# EAGLE design Linkable_LED_Matrix_Seperate_RES (EAGLE 6.5.0)
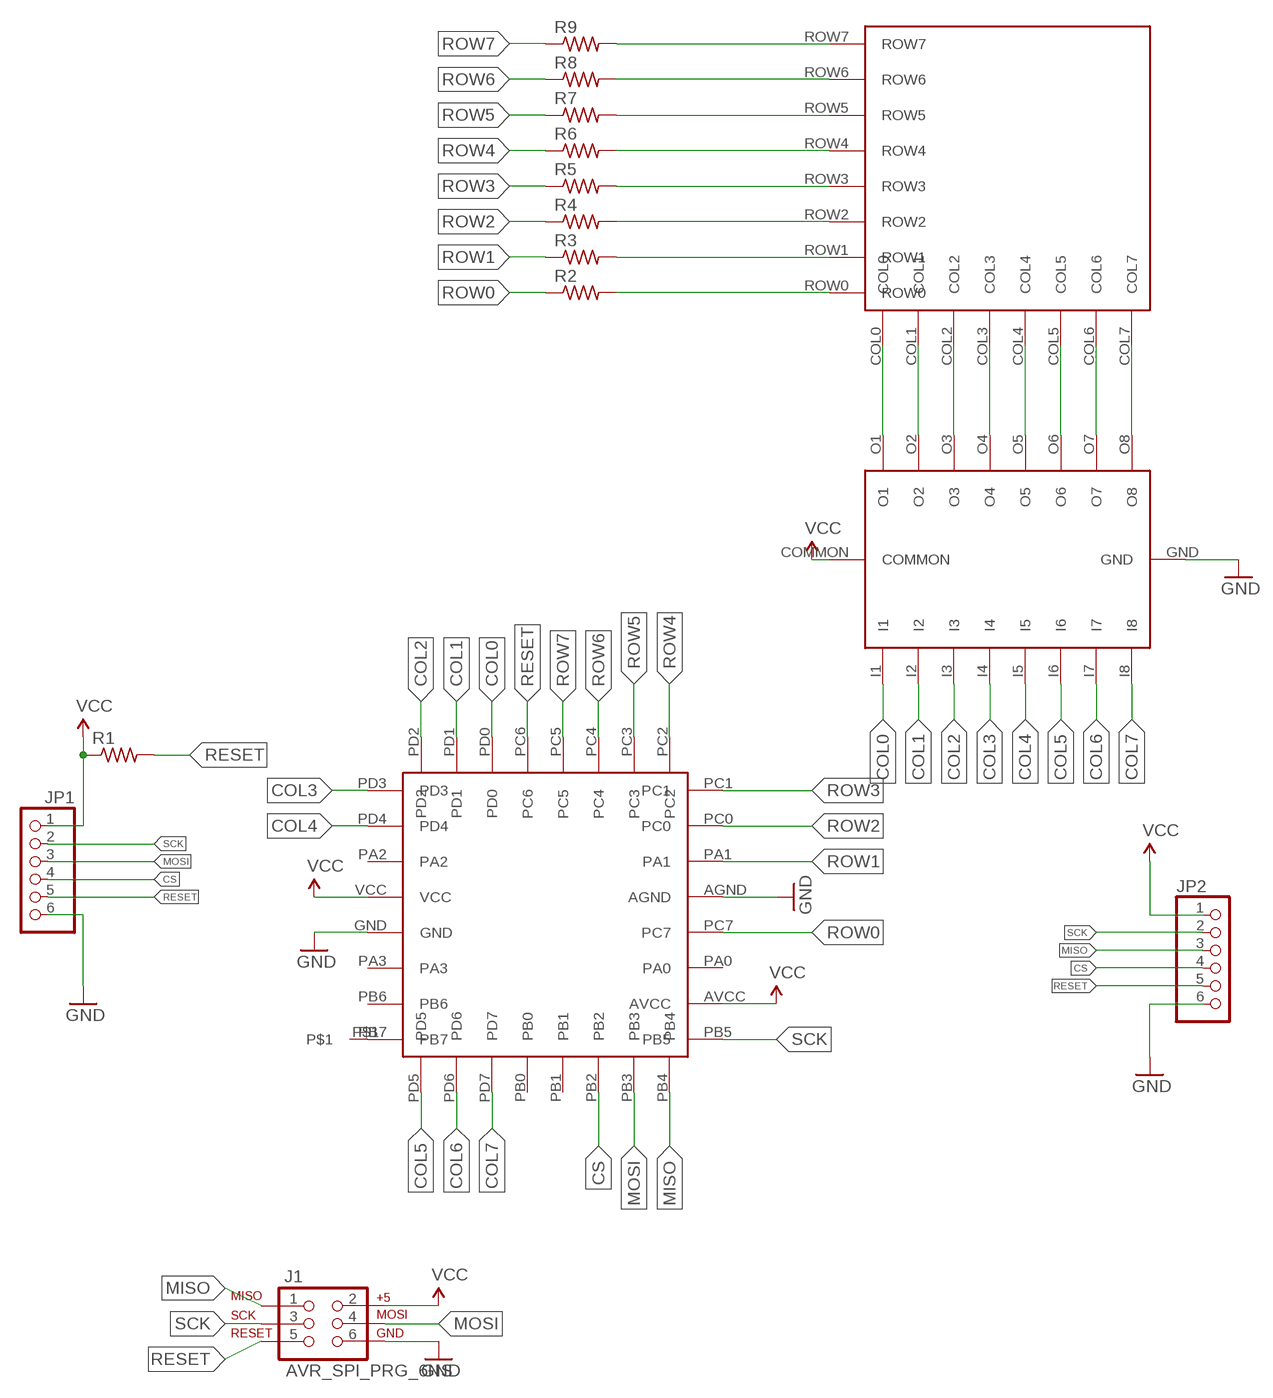
[diagram p0: schematic, sheet 1]

## Parts
J1  AVR_SPI_PRG_6NS  [2X3-NS]
JP1  PINHD-1X6  [1X06]
JP2  PINHD-1X6  [1X06]
R1  R-US_R0603  [R0603]
R2  R-US_R0603  [R0603]
R3  R-US_R0603  [R0603]
R4  R-US_R0603  [R0603]
R5  R-US_R0603  [R0603]
R6  R-US_R0603  [R0603]
R7  R-US_R0603  [R0603]
R8  R-US_R0603  [R0603]
R9  R-US_R0603  [R0603]
U$1  ATTINY48  [ATTINY48]
U$2  ULN2803AFWG  [ULN2803AFWG]
U$3  8X8_LED_MATRIX  [8X8_LED_MATRIX]
U$4  1X1MM_PAD  [1X1MM_PAD]

## Nets
COL0: U$1.PD0 U$2.I1
COL1: U$1.PD1 U$2.I2
COL2: U$1.PD2 U$2.I3
COL3: U$1.PD3 U$2.I4
COL4: U$1.PD4 U$2.I5
COL5: U$1.PD5 U$2.I6
COL6: U$1.PD6 U$2.I7
COL7: U$1.PD7 U$2.I8
CS: JP1.4 JP2.4 U$1.PB2
GND: J1.6 JP1.6 JP2.6 U$1.AGND U$1.GND U$2.GND
MISO: J1.1 JP2.3 U$1.PB4
MOSI: J1.4 JP1.3 U$1.PB3
N$1: U$2.O1 U$3.COL0
N$2: U$2.O2 U$3.COL1
N$3: U$2.O3 U$3.COL2
N$4: U$2.O4 U$3.COL3
N$5: U$2.O5 U$3.COL4
N$6: U$2.O6 U$3.COL5
N$7: U$2.O7 U$3.COL6
N$8: U$2.O8 U$3.COL7
N$13: U$1.PB7 U$4.P$1
N$25: R9.2 U$3.ROW7
N$26: R8.2 U$3.ROW6
N$27: R7.2 U$3.ROW5
N$28: R6.2 U$3.ROW4
N$29: R5.2 U$3.ROW3
N$30: R4.2 U$3.ROW2
N$31: R3.2 U$3.ROW1
N$32: R2.2 U$3.ROW0
RESET: J1.5 JP1.5 JP2.5 R1.2 U$1.PC6
ROW0: R2.1 U$1.PC7
ROW1: R3.1 U$1.PA1
ROW2: R4.1 U$1.PC0
ROW3: R5.1 U$1.PC1
ROW4: R6.1 U$1.PC2
ROW5: R7.1 U$1.PC3
ROW6: R8.1 U$1.PC4
ROW7: R9.1 U$1.PC5
SCK: J1.3 JP1.2 JP2.2 U$1.PB5
VCC: J1.2 JP1.1 JP2.1 R1.1 U$1.AVCC U$1.VCC U$2.COMMON
Unconnected: U$1.PA0 U$1.PA2 U$1.PA3 U$1.PB0 U$1.PB1 U$1.PB6

## Library data of the parts
J1 = SparkFun-Connectors:AVR_SPI_PRG_6: AVR ISP 6 Pin This is the reduced ISP connector for AVR programming. Common on Arduino. This footprint will take up less PCB space and can be used with a 10-pin to 6-pin adapter such as SKU: BOB-08508 **Special note about "TEST_POINT" package. The stop mask is on the top side, so if you want your programming test points to be on the bottom of your board, make sure to place this package on the bottom side of the board. This also ensure that the orientation to program from the bottom side will be correct.
JP1 JP2 = pinhead:PINHD-1X6: PIN HEADER
R1-R9 = resistor:R-US_: RESISTOR, American symbol
U$1 = ScottSilver:ATTINY48
U$2 = ScottSilver:ULN2803AFWG
U$3 = ScottSilver:8X8_LED_MATRIX
U$4 = ScottSilver:1X1MM_PAD

## Board
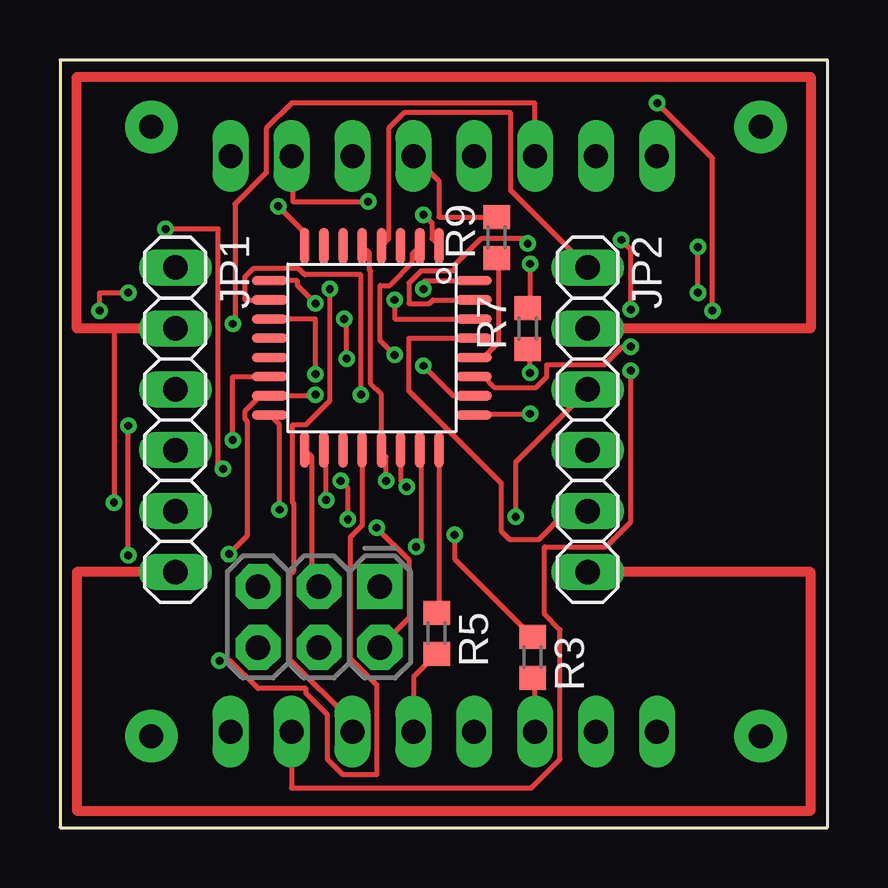
[diagram p1: board, top side]
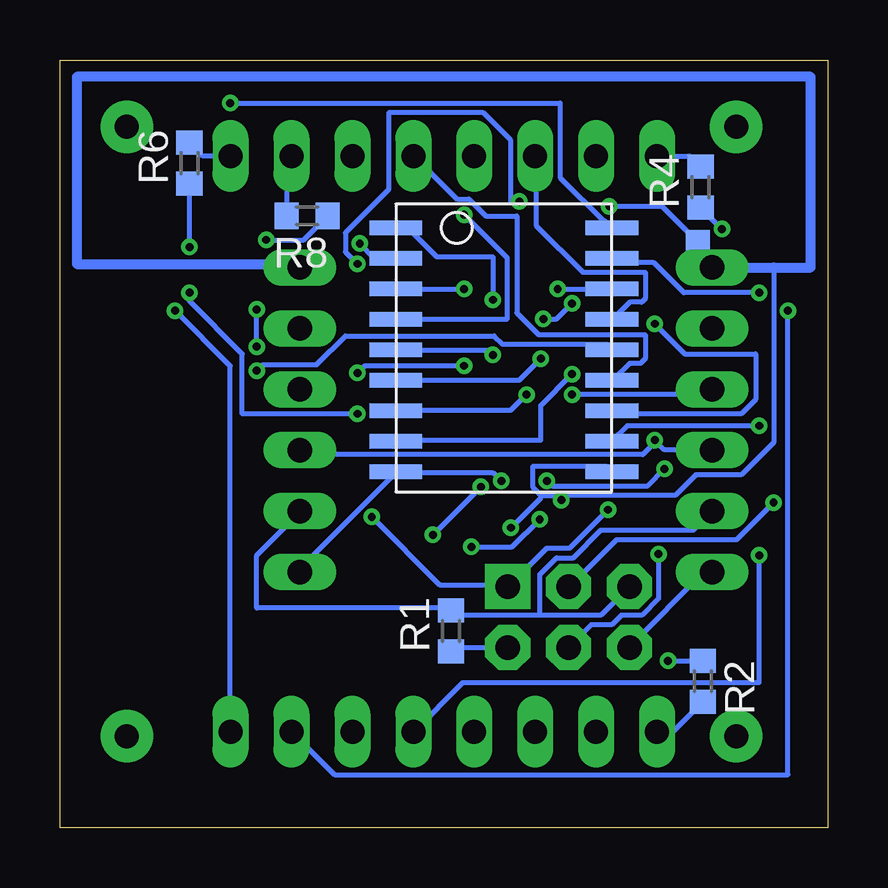
[diagram p2: board, bottom side, seen from below]

Size 32 x 32 mm. Coordinates in mm from the lower left corner, seen from the top.
Outline: 0,0 32,0 32,32 0,32 0,0
Copper layers (1*16): Top 0.0356mm / dielectric 1.5011mm / Bottom 0.0356mm
Design rules "LaenPCBOrder *": minimum track width 8mil, minimum drill 13mil, track to track 6mil, track to pad 6mil, pad to pad 6mil, via to via 6mil, smd to smd 6mil, copper to edge 15mil, drill to drill 6mil, minimum pad ring 7mil, minimum via ring 7mil, stop-mask expansion 3mil, vias tented up to drill 0mil, thermal gap 10mil
vRestrict: area 6.2,26.4 to 25.7,29.6; area 3.2,9.9 to 6.3,24.2; area 6.2,2.5 to 25.8,5.6; area 20.5,9.8 to 23.4,24.1; area 7.6,14 to 10.3,25.5; area 15.5,13.8 to 18.5,25.7; area 7,6 to 15,11; area 9.8,23.2 to 16.3,25.2; area 16.3,16.5 to 18.1,23.2; area 9.7,14.8 to 16.2,16.8

### Footprints (pad centres in the part's own frame; a part is rotated, then mirrored left to right if it is on the bottom)
2X3-NS = drill 1.016 pad 1.88 square: 1 -2.54,-1.27 | drill 1.016 pad 1.88 octagon: 2 -2.54,1.27; 3 0,-1.27; 4 0,1.27; 5 2.54,-1.27; 6 2.54,1.27
1X06 = drill 1.016 long: 1 -6.35,0; 2 -3.81,0; 3 -1.27,0; 4 1.27,0; 5 3.81,0; 6 6.35,0
R0603 = smd 1 x 1.1: 1 -0.85,0; 2 0.85,0
ATTINY48 = smd 1.5 x 0.406: AGND 4.25,0.4; AVCC 4.25,-2; GND -4.25,-0.4; PA0 4.25,-1.2; PA1 4.25,1.2; PA2 -4.25,1.2; PA3 -4.25,-1.2; PB5 4.25,-2.8; PB6 -4.25,-2; PB7 -4.25,-2.8; PC0 4.25,2; PC1 4.25,2.8; PC7 4.25,-0.4; PD3 -4.25,2.8; PD4 -4.25,2; VCC -4.25,0.4 | smd 0.406 x 1.5: PB0 -0.4,-4.25; PB1 0.4,-4.25; PB2 1.2,-4.25; PB3 2,-4.25; PB4 2.8,-4.25; PC2 2.8,4.25; PC3 2,4.25; PC4 1.2,4.25; PC5 0.4,4.25; PC6 -0.4,4.25; PD0 -1.2,4.25; PD1 -2,4.25; PD2 -2.8,4.25; PD5 -2.8,-4.25; PD6 -2,-4.25; PD7 -1.2,-4.25
ULN2803AFWG = smd 0.6 x 2.2: COMMON 10.16,9.01; GND 10.16,0; I1 0,0; I2 1.27,0; I3 2.54,0; I4 3.81,0; I5 5.08,0; I6 6.35,0; I7 7.62,0; I8 8.89,0; O1 0,9.01; O2 1.27,9.01; O3 2.54,9.01; O4 3.81,9.01; O5 5.08,9.01; O6 6.35,9.01; O7 7.62,9.01; O8 8.89,9.01
8X8_LED_MATRIX = drill 1 long: COL0 8.89,-12; COL1 6.35,-12; COL2 -3.81,-12; COL3 -3.81,12; COL4 -6.35,-12; COL5 1.27,12; COL6 3.81,12; COL7 1.27,-12; ROW0 -8.89,-12; ROW1 3.81,-12; ROW2 -8.89,12; ROW3 -1.27,-12; ROW4 8.89,12; ROW5 -6.35,12; ROW6 6.35,12; ROW7 -1.27,12
1X1MM_PAD = smd 1 x 1: P$1 0,0

### Placement (x,y rotation side)
J1  10.79,8.78 180 top
JP1  4.81,17 270 top
JP2  22,17 270 top
R1  15.7,8.2 90 bottom
R2  5.2,6.1 270 bottom
R3  19.7,7.1 270 top
R4  5.3,26.7 90 bottom
R5  15.7,8.1 270 top
R6  26.6,27.7 90 bottom
R7  19.5,20.8 90 top
R8  21.7,25.5 180 bottom
R9  18.2,24.6 90 top
U$1  13,20 270 top
U$2  18,25 270 bottom
U$3  16,16 0 top
U$4  5.4,24.4 0 bottom

### Tracks (layer width: path | path; a pad name or v marks a point on that pad's centre or on a via)
COL0  (via drill 0.33)
  Top 0.203: U$1.PD0 13.95,21.2 v13.95,22
  Bottom 0.203: v13.95,22 13.95,23.8 16.3,23.8 17.5,25 U$2.I1
COL1  (via drill 0.33)
  Top 0.203: U$1.PD1 15.55,22 15.4,21.85 14.55,21.85 14.55,22.7 15.05,23.2 16.45,23.2 16.45,23.45 17.55,24.55 19.5,24.55 v19.5,24.35
  Bottom 0.203: v19.5,24.35 18.9,23.75 18,23.75 U$2.I2
COL2  (via drill 0.33)
  Top 0.203: U$1.PD2 15.2,22.8 15.2,22.5 v15.15,22.45
  Bottom 0.203: v15.15,22.45 U$2.I3
COL3  (via drill 0.33)
  Top 0.203: U$1.PD3 15.5,24.55 15.5,25.2 v15.15,25.55
  Bottom 0.203: v15.15,25.55 13.35,23.75 13.35,21.2 U$2.I4
COL4  (via drill 0.33)
  Top 0.203: U$1.PD4 14.7,23.95 14.7,23.55 13.75,22.6 13.35,22.6 13.35,20.3 v13.95,19.7
  Bottom 0.203: v13.95,19.7 14.15,19.9 18,19.9 U$2.I5
COL5  (via drill 0.33)
  Top 0.203: U$1.PD5 9.9,22.8 9.9,22.6 v10.65,21.85 | v11.85,21.2 11.95,21.1 v11.95,19.55
  Bottom 0.203: v10.65,21.85 11.3,21.2 v11.85,21.2 | v11.95,19.55 12.85,18.65 U$2.I6
COL6  (via drill 0.33)
  Top 0.203: U$1.PD6 7.7,22 7.7,22.95 8.05,23.3 9.95,23.3 10.2,23.05 12.55,23.05 v12.55,18.05
  Bottom 0.203: v12.55,18.05 13.2,17.4 18,17.4 U$2.I7
COL7  (via drill 0.33)
  Top 0.203: U$1.PD7 10.65,21.2 v10.65,18.9
  Bottom 0.203: v10.65,18.9 11.95,17.6 11.95,16.15 18,16.15 U$2.I8
CS  (via drill 0.33)
  Top 0.203: U$1.PB2 7.2,18.8 v7.2,16.15
  Bottom 0.203: JP1.4 4.85,15.75 6.8,15.75 v7.2,16.15 7.2,16.05 7.7,15.55 21.85,15.55 22,15.7 JP2.4
GND  (via drill 0.33)
  Top 0.203: U$1.GND 12.9,23.95 12.9,23.25 12.95,23.2 12.95,18.5 13.4,18.05 U$1.AGND 13.4,15.65 13.6,15.45 v13.6,14.45
  Top 0.406: JP1.6 0.7,10.65 0.7,0.7 31.3,0.7 31.3,10.65 JP2.6
  Bottom 0.203: JP2.6 22,10.8 18,14.8 U$2.GND 17.9,14.8 13.95,14.8 v13.6,14.45 | JP1.6 5.15,10.65 8.25,7.55 J1.6
MISO  (via drill 0.33)
  Top 0.203: U$1.PB4 9.15,16.8 v9.15,13.25 | v19,12.95 19,15.25 22,18.25 JP2.3
  Bottom 0.203: v9.15,13.25 10.75,11.65 11.7,11.65 13.3,10.05 J1.1 13.4,10.1 16.15,10.1 v19,12.95
MOSI  (via drill 0.33)
  Top 0.203: v10.65,18.05 10.65,18 U$1.PB3 8.35,18 7.7,17.35 7.7,17.05 7.8,16.95 7.8,12.15 v7.05,11.4
  Bottom 0.203: v10.65,18.05 5.05,18.05 4.85,18.25 JP1.3 | J1.4 9.85,8.45 9,8.45 8.6,8.85 7.75,8.85 7.05,9.55 v7.05,11.4
N$1  (via drill 0.33)
  Top 0.203: v24.9,30.2 27.2,27.9 v27.2,21.55
  Bottom 0.203: v24.9,30.2 11.15,30.2 11.15,27.1 9.35,25.3 9.3,25.3 U$2.O1 | v27.2,21.55 24.9,19.25 U$3.COL0
N$2  (via drill 0.33)
  Top 0.203: v2.85,22.3 1.65,22.3 v1.65,21.55
  Bottom 0.203: v2.85,22.3 6,22.3 7.25,23.55 8.8,23.55 8.95,23.7 U$2.O2 | v1.65,21.55 1.65,2.2 20.55,2.2 U$3.COL1
N$3  (via drill 0.33)
  Top 0.203: v11.25,22.45 11.25,17.8 10.25,16.8 9.7,16.8 9.7,13.55 9.75,13.5 9.75,10.7 9.6,10.55 9.6,7 12.15,4.45 12.15,4 U$3.COL2
  Bottom 0.203: v11.25,22.45 U$2.O3
N$4
  Bottom 0.203: U$2.O4 8.95,21.2 8.25,21.9 7.75,21.9 7.6,22.05 7.6,23.15 10.2,23.15 12.15,25.1 12.15,28 U$3.COL3
N$5  (via drill 0.33)
  Top 0.203: v23.8,19.05 23.8,12.75 22.75,11.7 20.2,11.7 20.2,8.9 20.85,8.25 20.85,2.85 19.65,1.65 9.65,1.65 U$3.COL4
  Bottom 0.203: v23.8,19.05 23.55,19.3 21.3,19.3 20.1,20.5 13.9,20.5 13.55,20.15 9.2,20.15 9,19.95 U$2.O5
N$6
  Bottom 0.203: U$2.O6 8.95,18.65 8.25,19.35 7.8,19.35 7.6,19.55 7.6,20.55 12.05,20.55 12.95,21.45 12.95,25.5 14.25,25.5 14.95,26.2 15.45,26.2 17.25,28 U$3.COL5
N$7  (via drill 0.33)
  Top 0.203: v7.2,21 7.3,21.1 7.3,26 8.6,27.3 8.6,29.15 9.65,30.2 19.8,30.2 U$3.COL6
  Bottom 0.203: v7.2,21 5.95,19.75 3,19.75 3,17.85 3.6,17.25 8.85,17.25 8.95,17.35 U$2.O7
N$8  (via drill 0.33)
  Top 0.203: v2.85,11.35 v2.85,16.75
  Bottom 0.203: U$2.O8 8.35,16.75 v2.85,16.75 | v2.85,11.35 2.85,6.05 15.2,6.05 17.25,4 U$3.COL7
N$9  (via drill 1 pad 2.18)
  other vias: 3.81,29.21
N$10  (via drill 1 pad 2.18)
  other vias: 3.81,3.81
N$11  (via drill 1 pad 2.18)
  other vias: 29.21,29.21
N$12  (via drill 1 pad 2.18)
  other vias: 29.21,3.81
N$13  (via drill 0.33)
  Top 0.203: v9.1,25.9 10.2,24.8 U$1.PB7
  Bottom 0.203: U$4.P$1 6.9,25.9 v9.1,25.9
N$25
  Top 0.203: R9.2 15.8,25.45 15.8,26.95 14.75,28 U$3.ROW7
N$26
  Bottom 0.203: R8.2 22.55,28 U$3.ROW6
N$27  (via drill 0.33)
  Top 0.203: R7.2 19.6,21.75 v19.6,23.5 | v12.85,26.1 9.7,26.1 9.7,27.95 U$3.ROW5
  Bottom 0.203: v19.6,23.5 20.1,24 20.1,24.8 18.3,26.6 18.3,29.8 14.35,29.8 13.2,28.65 13.2,26.1 v12.85,26.1
N$28
  Bottom 0.203: R6.2 26.05,28 U$3.ROW4
N$29
  Top 0.203: R5.2 14.75,6.3 14.75,4 U$3.ROW3
N$30
  Bottom 0.203: R4.2 5.75,28 U$3.ROW2
N$31
  Top 0.203: R3.2 19.8,6.15 U$3.ROW1
N$32
  Bottom 0.203: R2.2 6.45,4 U$3.ROW0
RESET
  Top 0.203: U$1.PC6 14.55,20.4 14.55,18.2 18.4,14.35 18.4,12.35 18.75,12 19.95,12 21.1,13.15 22,13.15 JP2.5
  Bottom 0.203: 12,8.85 9.45,8.85 J1.5 | 12,8.85 15.5,8.85 R1.2 15.7,9.15 23.8,9.15 23.8,11.35 22,13.15 JP2.5 | JP1.5 5.6,12.4 9.45,12.4 10.6,11.25 11.3,11.25 12,10.55 12,8.85
ROW0  (via drill 0.33)
  Top 0.203: v6.65,6.95 7.1,6.95 8.25,5.8 10.25,5.8 10.25,5.6 11.15,4.7 11.15,2.85 11.8,2.2 13.2,2.2 13.2,5.95 12.1,7.05 12.1,12.1 12.6,12.6 U$1.PC7
  Bottom 0.203: v6.65,6.95 R2.1
ROW1  (via drill 0.33)
  Top 0.203: R3.1 16.45,11.2 v16.45,12.2 | v14.45,14.2 14.2,14.45 U$1.PA1
  Bottom 0.203: v14.45,14.2 v16.45,12.2
ROW2  (via drill 0.33)
  Top 0.203: v4.4,24.95 6.6,24.95 6.6,15.15 v6.8,14.95 | v11.7,14.45 12,14.15 v12,12.85 | v14.85,11.7 15.05,11.9 15.05,15.7 U$1.PC0
  Bottom 0.203: v4.4,24.95 R4.1 | v6.8,14.95 7.5,14.25 11.5,14.25 v11.7,14.45 | v12,12.85 13.15,11.7 v14.85,11.7
ROW3
  Top 0.203: R5.1 15.8,9.05 U$1.PC1
ROW4  (via drill 0.33)
  Top 0.203: v26.6,22.3 v26.6,24.2 | v19.6,17.25 17.25,17.25 U$1.PC2
  Bottom 0.203: v26.6,24.2 R6.1 | v26.6,22.3 26.6,21.95 24.4,19.75 24.4,17.25 v19.6,17.25
ROW5  (via drill 0.33)
  Top 0.203: R7.1 19.6,19.85 v19.6,18.95 | v15.15,19.25 16.4,18 U$1.PC3
  Bottom 0.203: v19.6,18.95 19.3,19.25 v15.15,19.25
ROW6  (via drill 0.33)
  Top 0.203: v23.4,24.5 23.8,24.1 v23.8,21.6 | v23.8,20.05 23.45,20.05 22.7,19.3 20.3,19.3 20.3,18.8 19.85,18.35 18.1,18.35 17.65,18.8 U$1.PC4
  Bottom 0.203: R8.1 21.85,24.5 v23.4,24.5 | v23.8,20.05 v23.8,21.6
ROW7
  Top 0.203: R9.1 18.3,23.65 18.3,20.25 17.65,19.6 U$1.PC5
SCK  (via drill 0.33)
  Top 0.203: U$1.PB5 10.5,15.45 10.5,10.3 10.75,10.05 J1.3 | 2.25,20.81 v2.25,13.55
  Top 0.406: JP1.2 2.25,20.81 0.7,20.81 0.7,31.3 31.3,31.3 31.3,20.81 JP2.2
  Bottom 0.203: v2.25,13.55 3.8,12 8.8,12 10.75,10.05 J1.3
VCC  (via drill 0.33)
  Top 0.203: U$1.AVCC 11.1,15.65 v11.1,13.65 | U$1.VCC 13.7,24.55 13.7,29.15 14.35,29.8 18.8,29.8 18.8,26.55 JP2.1 | v13.2,12.5 14.55,11.15 14.55,8.75 13.35,7.55 J1.2
  Bottom 0.203: R1.1 15.55,7.5 J1.2 | 11.95,13.85 11.3,13.85 v11.1,13.65 11,13.65 10.8,13.85 6.35,13.85 5.5,14.7 3.6,14.7 2.25,16.05 2.25,23.35 | 11.95,13.85 12.3,14.2 12.3,15.05 9.2,15.05 U$2.COMMON | v13.2,12.5 11.95,13.75 11.95,13.85
  Bottom 0.406: JP1.1 2.25,23.35 0.7,23.35 0.7,31.3 31.3,31.3 31.3,23.5 22,23.5 JP2.1